# Altium project STM32F429IGT6.PrjPCB
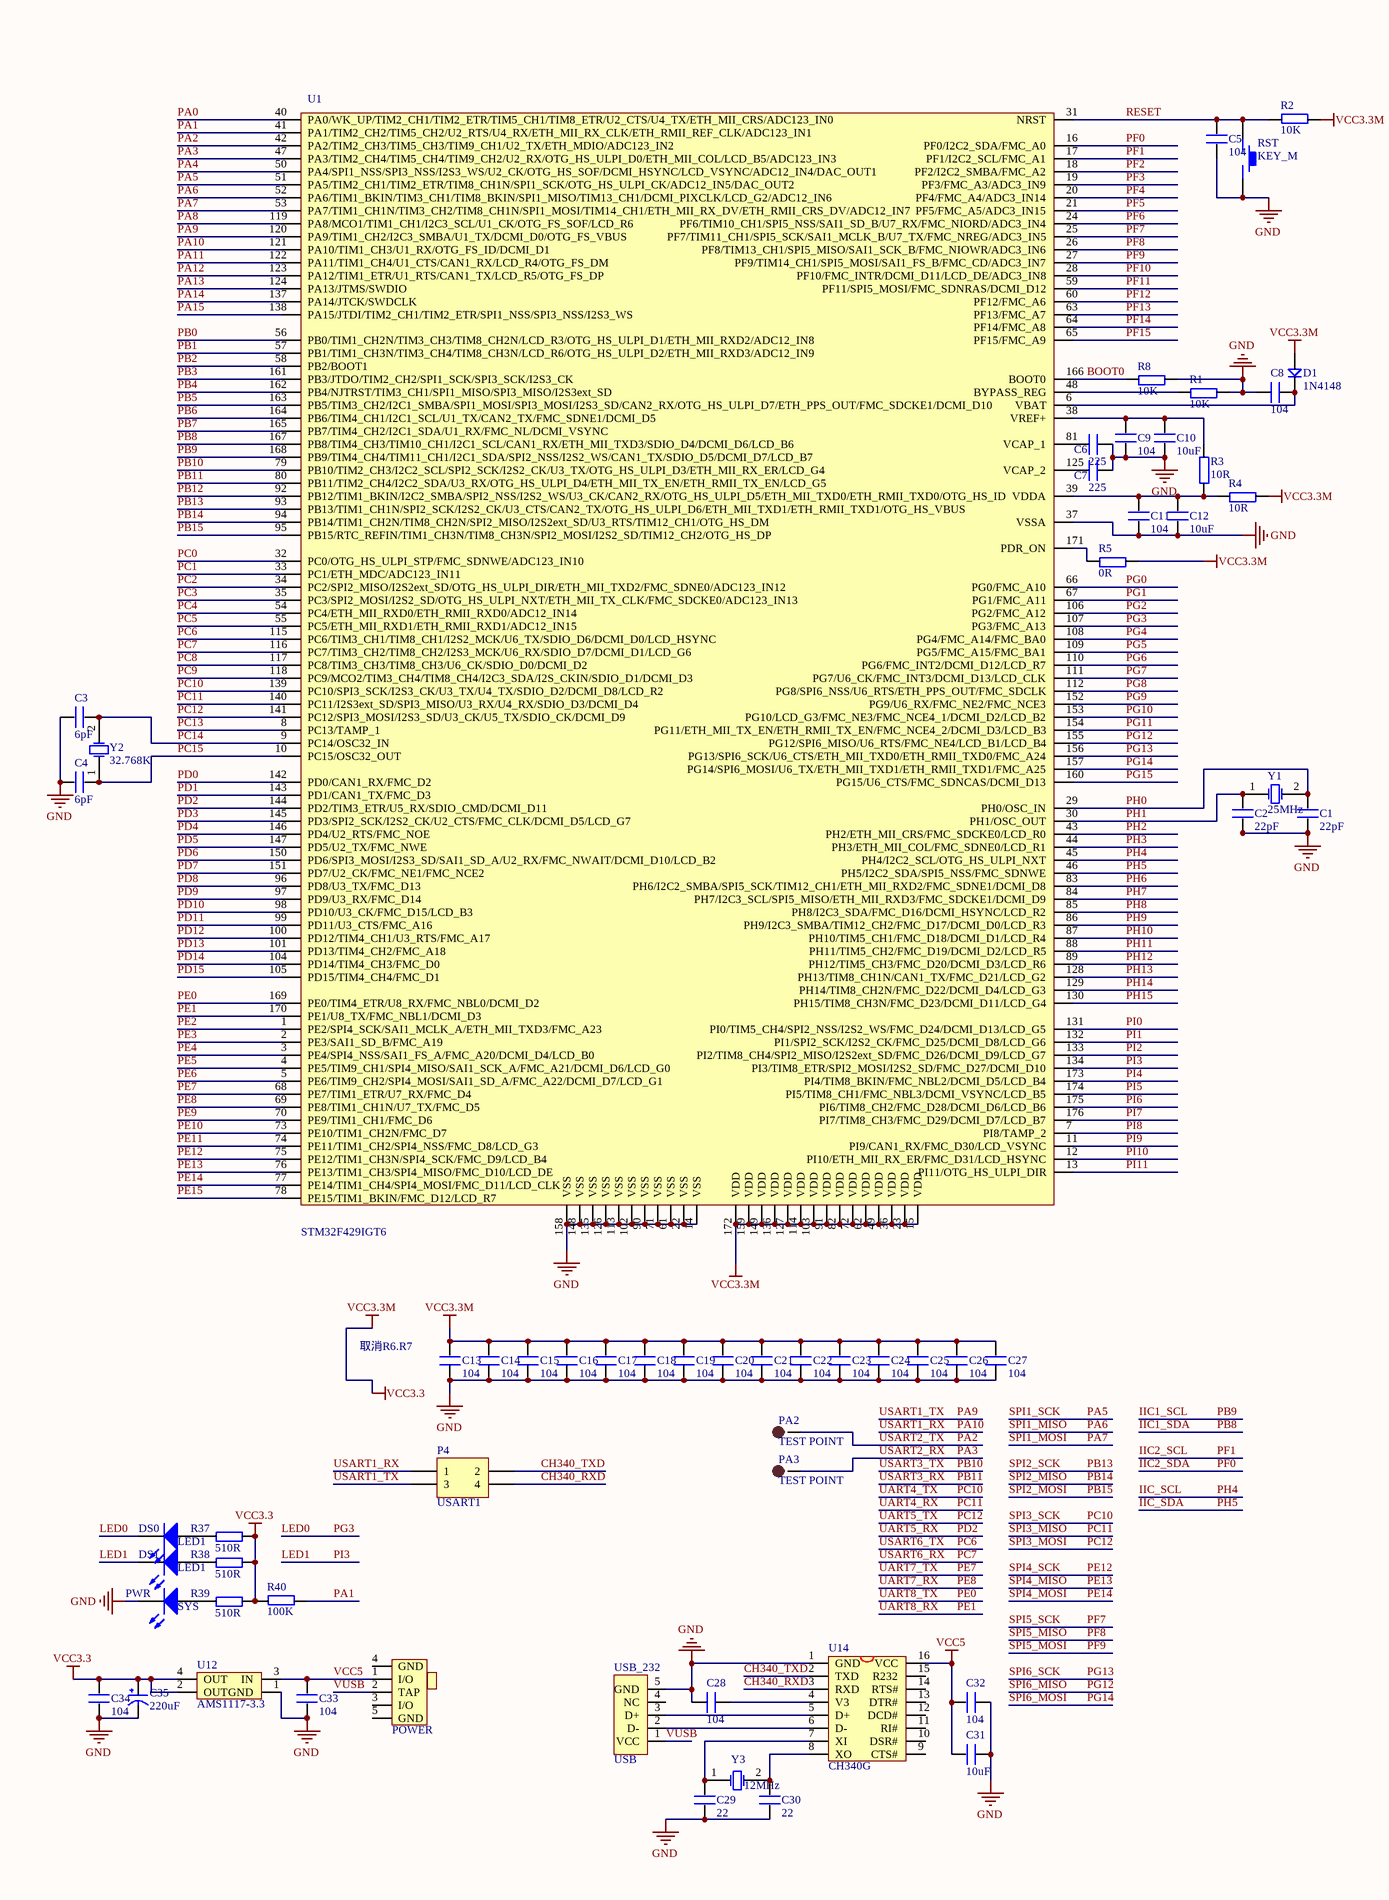
[diagram p0: STM32F429IGT6.SchDoc, left]
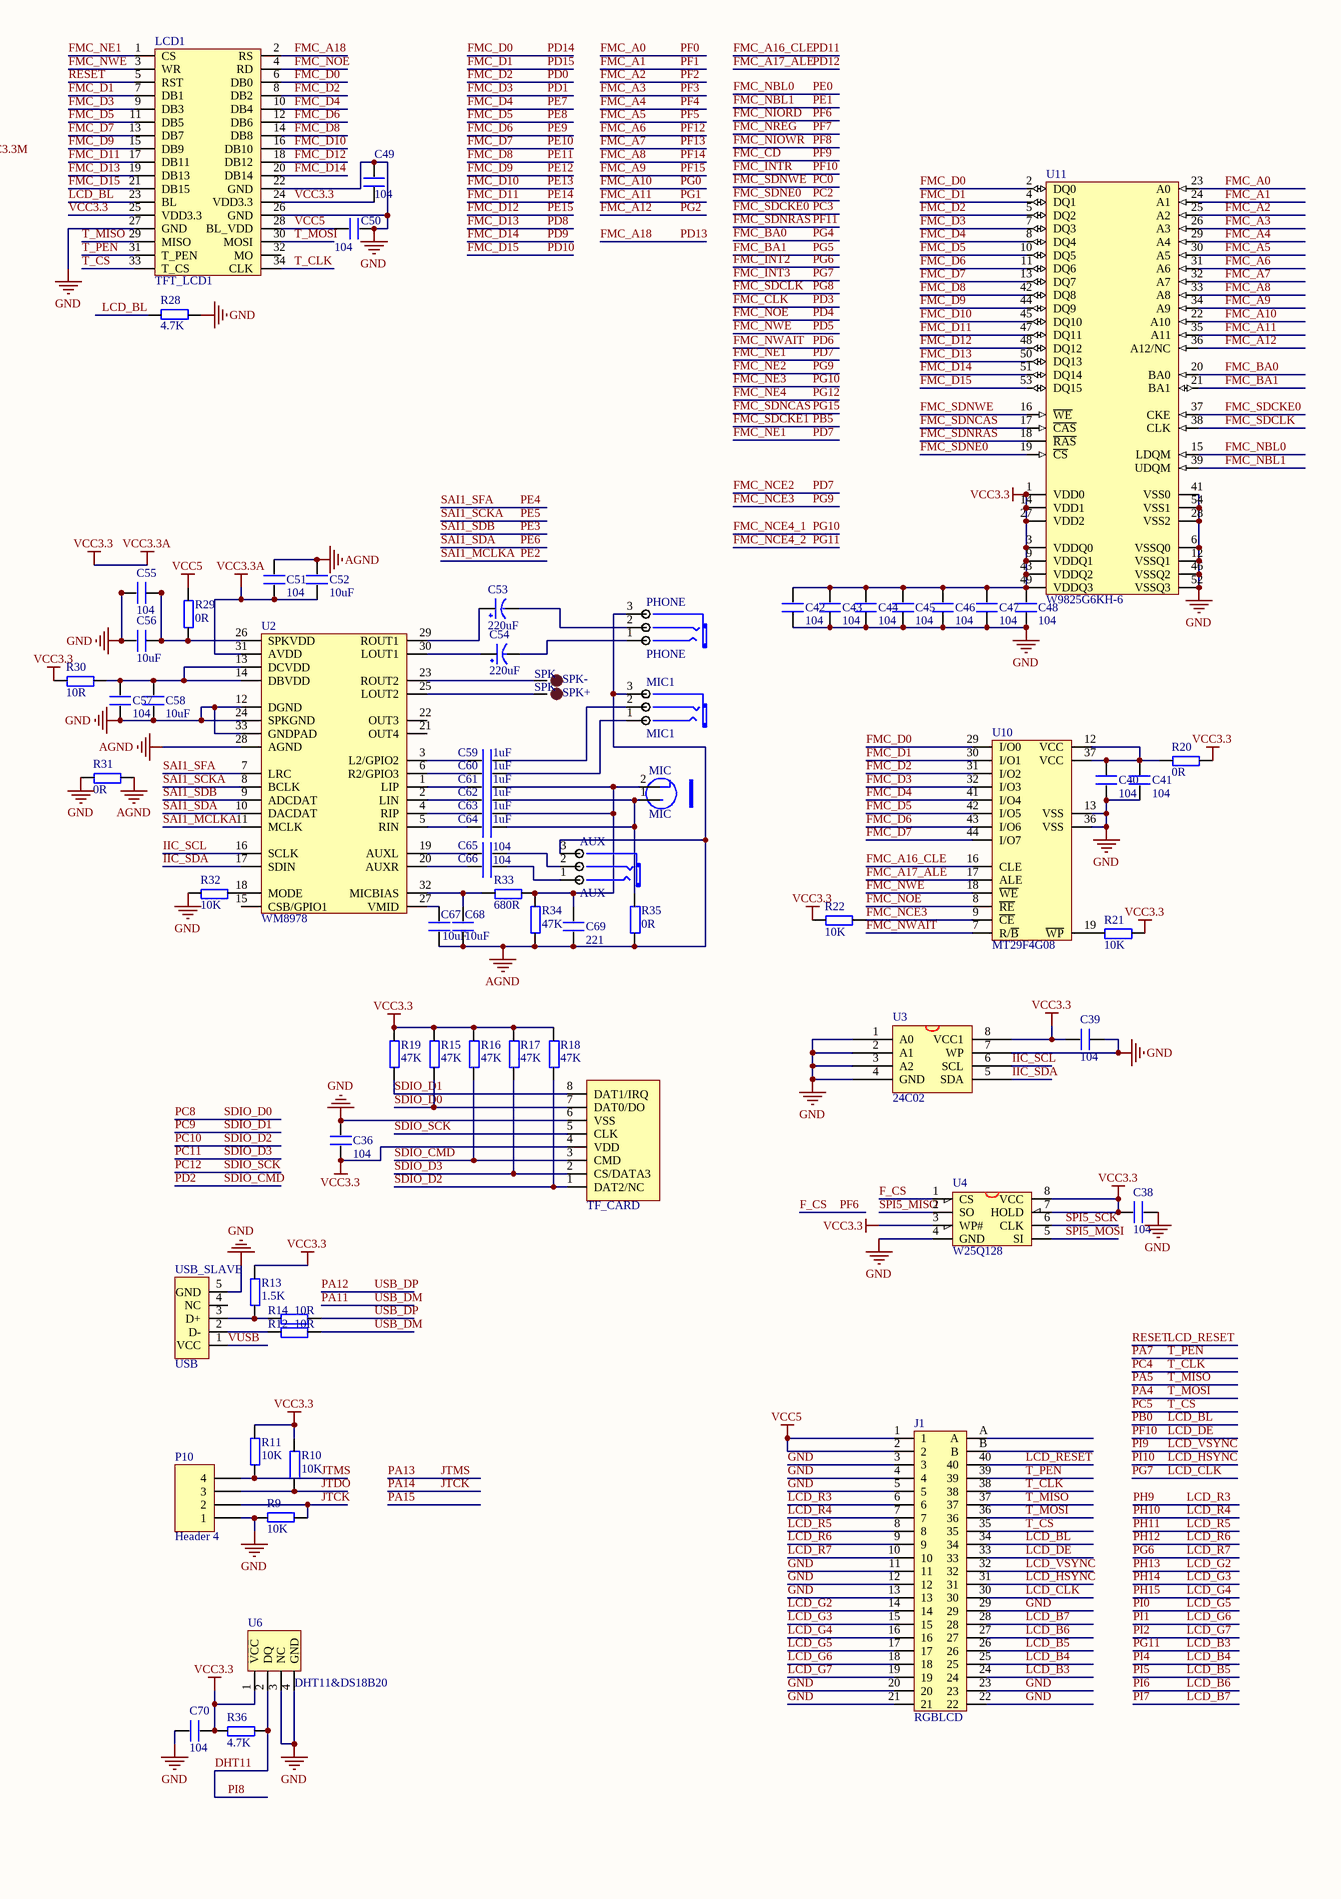
[diagram p1: STM32F429IGT6.SchDoc, right]
1 sheet, 135 parts. Net scope: global (net labels, ports and power ports of the same name join across sheets).
Board file: STM32F429IGT6.PcbDoc

## Sheet STM32F429IGT6.SchDoc
size A2

### Parts
AUX  AUX  [PHONE_ST]
C1  22pF  [C 0603_M]
C2  22pF  [C 0603_M]
C3  6pF  [C 0603_M]
C4  6pF  [C 0603_M]
C5  104  [C 0603_M]
C6  225  [C 0603_M]
C7  225  [C 0603_M]
C8  104  [C 0603_M]
C9  104  [C 0603_M]
C10  10uF  [C 0603_M]
C11  104  [C 0603_M]
C12  10uF  [C 0603_M]
C13  104  [C 0603_M]
C14  104  [C 0603_M]
C15  104  [C 0603_M]
C16  104  [C 0603_M]
C17  104  [C 0603_M]
C18  104  [C 0603_M]
C19  104  [C 0603_M]
C20  104  [C 0603_M]
C21  104  [C 0603_M]
C22  104  [C 0603_M]
C23  104  [C 0603_M]
C24  104  [C 0603_M]
C25  104  [C 0603_M]
C26  104  [C 0603_M]
C27  104  [C 0603_M]
C28  104  [C 0603_M]
C29  22  [C 0603_M]
C30  22  [C 0603_M]
C31  10uF  [C 0603_M]
C32  104  [C 0603_M]
C33  104  [C 0603_M]
C34  104  [C 0603_M]
C35  220uF  [CT 6*6 - C]
C36  104  [C 0603_M]
C38  104  [C 0603_M]
C39  104  [C 0603_M]
C40  104  [C 0603_M]
C41  104  [C 0603_M]
C42  104  [C 0603_M]
C43  104  [C 0603_M]
C44  104  [C 0603_M]
C45  104  [C 0603_M]
C46  104  [C 0603_M]
C47  104  [C 0603_M]
C48  104  [C 0603_M]
C49  104  [C 0603_M]
C50  104  [C 0603_M]
C51  104  [C 0603_M]
C52  10uF  [C 0603_M]
C53  220uF  [cc4*5.4]
C54  220uF  [cc4*5.4]
C55  104  [C 0603_M]
C56  10uF  [C 0603_M]
C57  104  [C 0603_M]
C58  10uF  [C 0603_M]
C59  1uF  [C 0603_M]
C60  1uF  [C 0603_M]
C61  1uF  [C 0603_M]
C62  1uF  [C 0603_M]
C63  1uF  [C 0603_M]
C64  1uF  [C 0603_M]
C65  104  [C 0603_M]
C66  104  [C 0603_M]
C67  10uF  [C 0603_M]
C68  10uF  [C 0603_M]
C69  221  [C 0603_M]
C70  104  [C 0603_M]
D1  1N4148  [DIODE_SOP]
DS0  LED1  [SMDLED]
DS1  LED1  [SMDLED]
J1  RGBLCD  [FPC-TOP40]
LCD1  TFT_LCD1  [DB2*17-3.5]
MIC  MIC  [MIC-6022]
MIC1  MIC1  [PHONE_ST]
P4  USART1  [HDR2.54-LI-2x2P]
P10  Header 4  [HDR2.54-LI-4P]
PA2  TEST POINT  [TP-1.5]
PA3  TEST POINT  [TP-1.5]
PHONE  PHONE  [PHONE_ST]
POWER  BUTTON_DIP3  [BTN8.8*4.6]  (value not drawn)
PWR  SYS  [SMDLED]
R1  10K  [R 0603_M]
R2  10K  [R 0603_M]
R3  10R  [R 0603_M]
R4  10R  [R 0603_M]
R5  0R  [R 0603_M]
R8  10K  [R 0603_M]
R9  10K  [R 0603_M]
R10  10K  [R 0603_M]
R11  10K  [R 0603_M]
R12  10R  [R 0603_M]
R13  1.5K  [R 0603_M]
R14  10R  [R 0603_M]
R15  47K  [R 0603_M]
R16  47K  [R 0603_M]
R17  47K  [R 0603_M]
R18  47K  [R 0603_M]
R19  47K  [R 0603_M]
R20  0R  [R 0603_M]
R21  10K  [R 0603_M]
R22  10K  [R 0603_M]
R28  4.7K  [R 0603_M]
R29  0R  [R 0603_M]
R30  10R  [R 0603_M]
R31  0R  [R 0603_M]
R32  10K  [R 0603_M]
R33  680R  [R 0603_M]
R34  47K  [R 0603_M]
R35  0R  [R 0603_M]
R36  4.7K  [R 0603_M]
R37  510R  [R 0603_M]
R38  510R  [R 0603_M]
R39  510R  [R 0603_M]
R40  100K  [R 0603_M]
RST  KEY_M  [TSW SMD-3*6*2.5]
SPK+  SPK  [TP-1.5]
SPK-  SPK  [TP-1.5]
TF_CARD  SD-MICRO-TF  [SD-MICRO-TF]  (value not drawn)
U1  STM32F429IGT6  [LQFP176]
U2  WM8978  [qfn32]
U3  24C02  [SOP8_M]
U4  W25Q128  [SOIC-8]
U6  DHT11&DS18B20  [DHT11]
U10  MT29F4G08  [TSOP48]
U11  W9825G6KH-6  [TSOP54]
U12  AMS1117-3.3  [AMS1117]
U14  CH340G  [SOP16_M]
USB_232  USB  [USB-MINI-A]
USB_SLAVE  USB  [USB-MINI-A]
Y1  25MHz  [OSC HC-49S]
Y2  32.768K  [OSC-2x6-WI-A]
Y3  12MHz  [OSC HC-49S]

### Nets
AGND: AUX.3(COM) C51.2 C52.2 C67.1 C68.1 C69.1 MIC1.3(COM) PHONE.3(COM) R31.2 R34.1 R35.1 U2.28(AGND)
GND: C1.2 C2.2 C3.1 C4.1 C5.1 C6.1 C7.1 C8.1 C9.1 C10.1 C11.1 C12.1 C13.1 C14.1 C15.1 C16.1 C17.1 C18.1 C19.1 C20.1 C21.1 C22.1 C23.1 C24.1 C25.1 C26.1 C27.1 C28.1 C29.1 C30.2 C31.2 C32.2 C33.1 C34.1 C35.2(GND) C36.2 C38.2 C39.2 C40.1 C41.1 C42.1 C43.1 C44.1 C45.1 C46.1 C47.1 C48.1 C49.2 C50.1 C55.1 C56.1 C57.1 C58.1 C70.1 J1.3 J1.4 J1.5 J1.11 J1.12 J1.13 J1.20 J1.21 J1.22 J1.23 J1.29 LCD1.22(GND) LCD1.26(GND) LCD1.27(GND) P10.1 PWR.2(K) R1.2 R8.2 R9.2 R28.1 R31.1 R32.1 RST.2 TF_CARD.6(VSS) U1.14(VSS) U1.22(VSS) U1.37(VSSA) U1.61(VSS) U1.71(VSS) U1.90(VSS) U1.102(VSS) U1.113(VSS) U1.126(VSS) U1.135(VSS) U1.148(VSS) U1.158(VSS) U2.12(DGND) U2.24(SPKGND) U2.33(GNDPAD) U3.1(A0) U3.2(A1) U3.3(A2) U3.4(GND) U3.7(WP) U4.4(GND) U6.3(NC) U6.4(GND) U10.13(VSS) U10.36(VSS) U11.6(VSSQ0) U11.12(VSSQ1) U11.28(VSS2) U11.41(VSS0) U11.46(VSSQ2) U11.52(VSSQ3) U11.54(VSS1) U12.1(GND) U14.1(GND) USB_232.5(GND) USB_SLAVE.5(GND)
VCC3.3: C13.2 C14.2 C15.2 C16.2 C17.2 C18.2 C19.2 C20.2 C21.2 C22.2 C23.2 C24.2 C25.2 C26.2 C27.2 C34.2 C35.1(VCC) C36.1 C38.1 C39.1 C42.2 C43.2 C44.2 C45.2 C46.2 C47.2 C48.2 C49.1 C51.1 C52.1 C70.2 D1.1 LCD1.24(VDD3.3) LCD1.25(VDD3.3) R2.1 R4.2 R5.2 R10.2 R11.2 R13.2 R15.2 R16.2 R17.2 R18.2 R19.2 R20.2 R21.2 R22.1 R30.1 R36.1 R37.2 R38.2 R39.2 R40.2 TF_CARD.4(VDD) U1.15(VDD) U1.23(VDD) U1.36(VDD) U1.49(VDD) U1.62(VDD) U1.72(VDD) U1.82(VDD) U1.91(VDD) U1.103(VDD) U1.114(VDD) U1.127(VDD) U1.136(VDD) U1.149(VDD) U1.159(VDD) U1.172(VDD) U2.31(AVDD) U3.8(VCC1) U4.3(WP#) U4.7(HOLD) U4.8(VCC) U6.1(VCC) U11.1(VDD0) U11.3(VDDQ0) U11.9(VDDQ1) U11.14(VDD1) U11.27(VDD2) U11.43(VDDQ2) U11.49(VDDQ3) U12.2(OUT) U12.4(OUT)  [also labelled VCC3.3A, VCC3.3M]
VCC5: C31.1 C32.1 C33.2 C50.2 J1.1 J1.2 LCD1.28(BL_VDD) POWER.1(I/O) R29.2 U12.3(IN) U14.16(VCC)
BOOT0: R8.1 U1.166(BOOT0)
CH340_RXD: P4.4 U14.3(RXD)
CH340_TXD: P4.2 U14.2(TXD)
DHT11: R36.2 U1.7(PI8/TAMP_2) U6.2(DQ)  [also labelled PI8]
F_CS: U1.24(PF6/TIM10_CH1/SPI5_NSS/SAI1_SD_B/U7_RX/FMC_NIORD/ADC3_IN4) U4.1(CS)  [also labelled FMC_NIORD, PF6]
FMC_A0: U1.16(PF0/I2C2_SDA/FMC_A0) U11.23(A0)  [also labelled IIC2_SDA, PF0]
FMC_A1: U1.17(PF1/I2C2_SCL/FMC_A1) U11.24(A1)  [also labelled IIC2_SCL, PF1]
FMC_A2: U1.18(PF2/I2C2_SMBA/FMC_A2) U11.25(A2)  [also labelled PF2]
FMC_A3: U1.19(PF3/FMC_A3/ADC3_IN9) U11.26(A3)  [also labelled PF3]
FMC_A4: U1.20(PF4/FMC_A4/ADC3_IN14) U11.29(A4)  [also labelled PF4]
FMC_A5: U1.21(PF5/FMC_A5/ADC3_IN15) U11.30(A5)  [also labelled PF5]
FMC_A6: U1.60(PF12/FMC_A6) U11.31(A6)  [also labelled PF12]
FMC_A7: U1.63(PF13/FMC_A7) U11.32(A7)  [also labelled PF13]
FMC_A8: U1.64(PF14/FMC_A8) U11.33(A8)  [also labelled PF14]
FMC_A9: U1.65(PF15/FMC_A9) U11.34(A9)  [also labelled PF15]
FMC_A10: U1.66(PG0/FMC_A10) U11.22(A10)  [also labelled PG0]
FMC_A11: U1.67(PG1/FMC_A11) U11.35(A11)  [also labelled PG1]
FMC_A12: U1.106(PG2/FMC_A12) U11.36(A12/NC)  [also labelled PG2]
FMC_A16_CLE: U1.99(PD11/U3_CTS/FMC_A16) U10.16(CLE)  [also labelled PD11]
FMC_A17_ALE: U1.100(PD12/TIM4_CH1/U3_RTS/FMC_A17) U10.17(ALE)  [also labelled PD12]
FMC_A18: LCD1.2(RS) U1.101(PD13/TIM4_CH2/FMC_A18)  [also labelled PD13]
FMC_BA0: U1.108(PG4/FMC_A14/FMC_BA0) U11.20(BA0)  [also labelled PG4]
FMC_BA1: U1.109(PG5/FMC_A15/FMC_BA1) U11.21(BA1)  [also labelled PG5]
FMC_CD: U1.27(PF9/TIM14_CH1/SPI5_MOSI/SAI1_FS_B/FMC_CD/ADC3_IN7) U4.5(SI)  [also labelled PF9, SPI5_MOSI]
FMC_CLK: U1.145(PD3/SPI2_SCK/I2S2_CK/U2_CTS/FMC_CLK/DCMI_D5/LCD_G7)  [also labelled PD3]
FMC_D0: LCD1.6(DB0) U1.104(PD14/TIM4_CH3/FMC_D0) U10.29(I/O0) U11.2(DQ0)  [also labelled PD14]
FMC_D1: LCD1.7(DB1) U1.105(PD15/TIM4_CH4/FMC_D1) U10.30(I/O1) U11.4(DQ1)  [also labelled PD15]
FMC_D2: LCD1.8(DB2) U1.142(PD0/CAN1_RX/FMC_D2) U10.31(I/O2) U11.5(DQ2)  [also labelled PD0]
FMC_D3: LCD1.9(DB3) U1.143(PD1/CAN1_TX/FMC_D3) U10.32(I/O3) U11.7(DQ3)  [also labelled PD1]
FMC_D4: LCD1.10(DB4) U1.68(PE7/TIM1_ETR/U7_RX/FMC_D4) U10.41(I/O4) U11.8(DQ4)  [also labelled PE7, UART7_TX]
FMC_D5: LCD1.11(DB5) U1.69(PE8/TIM1_CH1N/U7_TX/FMC_D5) U10.42(I/O5) U11.10(DQ5)  [also labelled PE8, UART7_RX]
FMC_D6: LCD1.12(DB6) U1.70(PE9/TIM1_CH1/FMC_D6) U10.43(I/O6) U11.11(DQ6)  [also labelled PE9]
FMC_D7: LCD1.13(DB7) U1.73(PE10/TIM1_CH2N/FMC_D7) U10.44(I/O7) U11.13(DQ7)  [also labelled PE10]
FMC_D8: LCD1.14(DB8) U1.74(PE11/TIM1_CH2/SPI4_NSS/FMC_D8/LCD_G3) U11.42(DQ8)  [also labelled PE11]
FMC_D9: LCD1.15(DB9) U1.75(PE12/TIM1_CH3N/SPI4_SCK/FMC_D9/LCD_B4) U11.44(DQ9)  [also labelled PE12, SPI4_SCK]
FMC_D10: LCD1.16(DB10) U1.76(PE13/TIM1_CH3/SPI4_MISO/FMC_D10/LCD_DE) U11.45(DQ10)  [also labelled PE13, SPI4_MISO]
FMC_D11: LCD1.17(DB11) U1.77(PE14/TIM1_CH4/SPI4_MOSI/FMC_D11/LCD_CLK) U11.47(DQ11)  [also labelled PE14, SPI4_MOSI]
FMC_D12: LCD1.18(DB12) U1.78(PE15/TIM1_BKIN/FMC_D12/LCD_R7) U11.48(DQ12)  [also labelled PE15]
FMC_D13: LCD1.19(DB13) U1.96(PD8/U3_TX/FMC_D13) U11.50(DQ13)  [also labelled PD8]
FMC_D14: LCD1.20(DB14) U1.97(PD9/U3_RX/FMC_D14) U11.51(DQ14)  [also labelled PD9]
FMC_D15: LCD1.21(DB15) U1.98(PD10/U3_CK/FMC_D15/LCD_B3) U11.53(DQ15)  [also labelled PD10]
FMC_INT2: J1.10 U1.110(PG6/FMC_INT2/DCMI_D12/LCD_R7)  [also labelled LCD_R7, PG6]
FMC_INT3: J1.30 U1.111(PG7/U6_CK/FMC_INT3/DCMI_D13/LCD_CLK)  [also labelled LCD_CLK, PG7]
FMC_INTR: J1.33 U1.28(PF10/FMC_INTR/DCMI_D11/LCD_DE/ADC3_IN8)  [also labelled LCD_DE, PF10]
FMC_NBL0: U1.169(PE0/TIM4_ETR/U8_RX/FMC_NBL0/DCMI_D2) U11.15(LDQM)  [also labelled PE0, UART8_TX]
FMC_NBL1: U1.170(PE1/U8_TX/FMC_NBL1/DCMI_D3) U11.39(UDQM)  [also labelled PE1, UART8_RX]
FMC_NCE2: LCD1.1(CS) U1.151(PD7/U2_CK/FMC_NE1/FMC_NCE2)  [also labelled FMC_NE1, PD7]
FMC_NCE3: R22.2 U1.152(PG9/U6_RX/FMC_NE2/FMC_NCE3) U10.9(~{CE})  [also labelled FMC_NE2, PG9]
FMC_NCE4_1: U1.153(PG10/LCD_G3/FMC_NE3/FMC_NCE4_1/DCMI_D2/LCD_B2)  [also labelled FMC_NE3, PG10]
FMC_NCE4_2: J1.24 U1.154(PG11/ETH_MII_TX_EN/ETH_RMII_TX_EN/FMC_NCE4_2/DCMI_D3/LCD_B3)  [also labelled LCD_B3, PG11]
FMC_NE4: U1.155(PG12/SPI6_MISO/U6_RTS/FMC_NE4/LCD_B1/LCD_B4)  [also labelled PG12, SPI6_MISO]
FMC_NIOWR: U1.26(PF8/TIM13_CH1/SPI5_MISO/SAI1_SCK_B/FMC_NIOWR/ADC3_IN6) U4.2(SO)  [also labelled PF8, SPI5_MISO]
FMC_NOE: LCD1.4(RD) U1.146(PD4/U2_RTS/FMC_NOE) U10.8(~{RE})  [also labelled PD4]
FMC_NREG: U1.25(PF7/TIM11_CH1/SPI5_SCK/SAI1_MCLK_B/U7_TX/FMC_NREG/ADC3_IN5) U4.6(CLK)  [also labelled PF7, SPI5_SCK]
FMC_NWAIT: U1.150(PD6/SPI3_MOSI/I2S3_SD/SAI1_SD_A/U2_RX/FMC_NWAIT/DCMI_D10/LCD_B2) U10.7(R/~{B})  [also labelled PD6]
FMC_NWE: LCD1.3(WR) U1.147(PD5/U2_TX/FMC_NWE) U10.18(~{WE})  [also labelled PD5]
FMC_SDCKE0: U1.35(PC3/SPI2_MOSI/I2S2_SD/OTG_HS_ULPI_NXT/ETH_MII_TX_CLK/FMC_SDCKE0/ADC123_IN13) U11.37(CKE)  [also labelled PC3]
FMC_SDCKE1: U1.163(PB5/TIM3_CH2/I2C1_SMBA/SPI1_MOSI/SPI3_MOSI/I2S3_SD/CAN2_RX/OTG_HS_ULPI_D7/ETH_PPS_OUT/FMC_SDCKE1/DCMI_D10)  [also labelled PB5]
FMC_SDCLK: U1.112(PG8/SPI6_NSS/U6_RTS/ETH_PPS_OUT/FMC_SDCLK) U11.38(CLK)  [also labelled PG8]
FMC_SDNCAS: U1.160(PG15/U6_CTS/FMC_SDNCAS/DCMI_D13) U11.17(~{CAS})  [also labelled PG15]
FMC_SDNE0: U1.34(PC2/SPI2_MISO/I2S2ext_SD/OTG_HS_ULPI_DIR/ETH_MII_TXD2/FMC_SDNE0/ADC123_IN12) U11.19(~{CS})  [also labelled PC2]
FMC_SDNRAS: U1.59(PF11/SPI5_MOSI/FMC_SDNRAS/DCMI_D12) U11.18(~{RAS})  [also labelled PF11]
FMC_SDNWE: U1.32(PC0/OTG_HS_ULPI_STP/FMC_SDNWE/ADC123_IN10) U11.16(~{WE})  [also labelled PC0]
IIC1_SCL: U1.168(PB9/TIM4_CH4/TIM11_CH1/I2C1_SDA/SPI2_NSS/I2S2_WS/CAN1_TX/SDIO_D5/DCMI_D7/LCD_B7)  [also labelled PB9]
IIC1_SDA: U1.167(PB8/TIM4_CH3/TIM10_CH1/I2C1_SCL/CAN1_RX/ETH_MII_TXD3/SDIO_D4/DCMI_D6/LCD_B6)  [also labelled PB8]
IIC_SCL: U1.45(PH4/I2C2_SCL/OTG_HS_ULPI_NXT) U2.16(SCLK) U3.6(SCL)  [also labelled PH4]
IIC_SDA: U1.46(PH5/I2C2_SDA/SPI5_NSS/FMC_SDNWE) U2.17(SDIN) U3.5(SDA)  [also labelled PH5]
JTCK: P10.2 R9.1 U1.137(PA14/JTCK/SWDCLK)  [also labelled PA14]
JTDO: P10.3 R10.1
JTMS: P10.4 R11.1 U1.124(PA13/JTMS/SWDIO)  [also labelled PA13]
LCD_B4: J1.25 U1.173(PI4/TIM8_BKIN/FMC_NBL2/DCMI_D5/LCD_B4)  [also labelled PI4]
LCD_B5: J1.26 U1.174(PI5/TIM8_CH1/FMC_NBL3/DCMI_VSYNC/LCD_B5)  [also labelled PI5]
LCD_B6: J1.27 U1.175(PI6/TIM8_CH2/FMC_D28/DCMI_D6/LCD_B6)  [also labelled PI6]
LCD_B7: J1.28 U1.176(PI7/TIM8_CH3/FMC_D29/DCMI_D7/LCD_B7)  [also labelled PI7]
LCD_BL: J1.34 LCD1.23(BL) R28.2 U1.56(PB0/TIM1_CH2N/TIM3_CH3/TIM8_CH2N/LCD_R3/OTG_HS_ULPI_D1/ETH_MII_RXD2/ADC12_IN8)  [also labelled PB0]
LCD_G2: J1.14 U1.128(PH13/TIM8_CH1N/CAN1_TX/FMC_D21/LCD_G2)  [also labelled PH13]
LCD_G3: J1.15 U1.129(PH14/TIM8_CH2N/FMC_D22/DCMI_D4/LCD_G3)  [also labelled PH14]
LCD_G4: J1.16 U1.130(PH15/TIM8_CH3N/FMC_D23/DCMI_D11/LCD_G4)  [also labelled PH15]
LCD_G5: J1.17 U1.131(PI0/TIM5_CH4/SPI2_NSS/I2S2_WS/FMC_D24/DCMI_D13/LCD_G5)  [also labelled PI0]
LCD_G6: J1.18 U1.132(PI1/SPI2_SCK/I2S2_CK/FMC_D25/DCMI_D8/LCD_G6)  [also labelled PI1]
LCD_G7: J1.19 U1.133(PI2/TIM8_CH4/SPI2_MISO/I2S2ext_SD/FMC_D26/DCMI_D9/LCD_G7)  [also labelled PI2]
LCD_HSYNC: J1.31 U1.12(PI10/ETH_MII_RX_ER/FMC_D31/LCD_HSYNC)  [also labelled PI10]
LCD_R3: J1.6 U1.86(PH9/I2C3_SMBA/TIM12_CH2/FMC_D17/DCMI_D0/LCD_R3)  [also labelled PH9]
LCD_R4: J1.7 U1.87(PH10/TIM5_CH1/FMC_D18/DCMI_D1/LCD_R4)  [also labelled PH10]
LCD_R5: J1.8 U1.88(PH11/TIM5_CH2/FMC_D19/DCMI_D2/LCD_R5)  [also labelled PH11]
LCD_R6: J1.9 U1.89(PH12/TIM5_CH3/FMC_D20/DCMI_D3/LCD_R6)  [also labelled PH12]
LCD_RESET: C5.2 J1.40 LCD1.5(RST) R2.2 RST.1 U1.31(NRST)  [also labelled RESET]
LCD_VSYNC: J1.32 U1.11(PI9/CAN1_RX/FMC_D30/LCD_VSYNC)  [also labelled PI9]
LED0: DS0.2(K) U1.107(PG3/FMC_A13)  [also labelled PG3]
LED1: DS1.2(K) U1.134(PI3/TIM8_ETR/SPI2_MOSI/I2S2_SD/FMC_D27/DCMI_D10)  [also labelled PI3]
PA0: U1.40(PA0/WK_UP/TIM2_CH1/TIM2_ETR/TIM5_CH1/TIM8_ETR/U2_CTS/U4_TX/ETH_MII_CRS/ADC123_IN0)
PA1: R40.1 U1.41(PA1/TIM2_CH2/TIM5_CH2/U2_RTS/U4_RX/ETH_MII_RX_CLK/ETH_RMII_REF_CLK/ADC123_IN1)
PA2: PA2.1 U1.42(PA2/TIM2_CH3/TIM5_CH3/TIM9_CH1/U2_TX/ETH_MDIO/ADC123_IN2)  [also labelled USART2_TX]
PA3: PA3.1 U1.47(PA3/TIM2_CH4/TIM5_CH4/TIM9_CH2/U2_RX/OTG_HS_ULPI_D0/ETH_MII_COL/LCD_B5/ADC123_IN3)  [also labelled USART2_RX]
PA4: J1.36 LCD1.30(MOSI) U1.50(PA4/SPI1_NSS/SPI3_NSS/I2S3_WS/U2_CK/OTG_HS_SOF/DCMI_HSYNC/LCD_VSYNC/ADC12_IN4/DAC_OUT1)  [also labelled T_MOSI]
PA5: J1.37 LCD1.29(MISO) U1.51(PA5/TIM2_CH1/TIM2_ETR/TIM8_CH1N/SPI1_SCK/OTG_HS_ULPI_CK/ADC12_IN5/DAC_OUT2)  [also labelled SPI1_SCK, T_MISO]
PA6: U1.52(PA6/TIM1_BKIN/TIM3_CH1/TIM8_BKIN/SPI1_MISO/TIM13_CH1/DCMI_PIXCLK/LCD_G2/ADC12_IN6)  [also labelled SPI1_MISO]
PA7: J1.39 LCD1.31(T_PEN) U1.53(PA7/TIM1_CH1N/TIM3_CH2/TIM8_CH1N/SPI1_MOSI/TIM14_CH1/ETH_MII_RX_DV/ETH_RMII_CRS_DV/ADC12_IN7)  [also labelled SPI1_MOSI, T_PEN]
PA8: U1.119(PA8/MCO1/TIM1_CH1/I2C3_SCL/U1_CK/OTG_FS_SOF/LCD_R6)
PA9: P4.3 U1.120(PA9/TIM1_CH2/I2C3_SMBA/U1_TX/DCMI_D0/OTG_FS_VBUS)  [also labelled USART1_TX]
PA10: P4.1 U1.121(PA10/TIM1_CH3/U1_RX/OTG_FS_ID/DCMI_D1)  [also labelled USART1_RX]
PA11: R12.2 U1.122(PA11/TIM1_CH4/U1_CTS/CAN1_RX/LCD_R4/OTG_FS_DM)  [also labelled USB_DM]
PA12: R14.2 U1.123(PA12/TIM1_ETR/U1_RTS/CAN1_TX/LCD_R5/OTG_FS_DP)  [also labelled USB_DP]
PA15: U1.138(PA15/JTDI/TIM2_CH1/TIM2_ETR/SPI1_NSS/SPI3_NSS/I2S3_WS)
PB1: U1.57(PB1/TIM1_CH3N/TIM3_CH4/TIM8_CH3N/LCD_R6/OTG_HS_ULPI_D2/ETH_MII_RXD3/ADC12_IN9)
PB2: U1.58(PB2/BOOT1)
PB3: U1.161(PB3/JTDO/TIM2_CH2/SPI1_SCK/SPI3_SCK/I2S3_CK)
PB4: U1.162(PB4/NJTRST/TIM3_CH1/SPI1_MISO/SPI3_MISO/I2S3ext_SD)
PB6: U1.164(PB6/TIM4_CH1/I2C1_SCL/U1_TX/CAN2_TX/FMC_SDNE1/DCMI_D5)
PB7: U1.165(PB7/TIM4_CH2/I2C1_SDA/U1_RX/FMC_NL/DCMI_VSYNC)
PB10: U1.79(PB10/TIM2_CH3/I2C2_SCL/SPI2_SCK/I2S2_CK/U3_TX/OTG_HS_ULPI_D3/ETH_MII_RX_ER/LCD_G4)  [also labelled USART3_TX]
PB11: U1.80(PB11/TIM2_CH4/I2C2_SDA/U3_RX/OTG_HS_ULPI_D4/ETH_MII_TX_EN/ETH_RMII_TX_EN/LCD_G5)  [also labelled USART3_RX]
PB12: U1.92(PB12/TIM1_BKIN/I2C2_SMBA/SPI2_NSS/I2S2_WS/U3_CK/CAN2_RX/OTG_HS_ULPI_D5/ETH_MII_TXD0/ETH_RMII_TXD0/OTG_HS_ID)
PB13: U1.93(PB13/TIM1_CH1N/SPI2_SCK/I2S2_CK/U3_CTS/CAN2_TX/OTG_HS_ULPI_D6/ETH_MII_TXD1/ETH_RMII_TXD1/OTG_HS_VBUS)  [also labelled SPI2_SCK]
PB14: U1.94(PB14/TIM1_CH2N/TIM8_CH2N/SPI2_MISO/I2S2ext_SD/U3_RTS/TIM12_CH1/OTG_HS_DM)  [also labelled SPI2_MISO]
PB15: U1.95(PB15/RTC_REFIN/TIM1_CH3N/TIM8_CH3N/SPI2_MOSI/I2S2_SD/TIM12_CH2/OTG_HS_DP)  [also labelled SPI2_MOSI]
PC1: U1.33(PC1/ETH_MDC/ADC123_IN11)
PC4: J1.38 LCD1.34(CLK) U1.54(PC4/ETH_MII_RXD0/ETH_RMII_RXD0/ADC12_IN14)  [also labelled T_CLK]
PC5: J1.35 LCD1.33(T_CS) U1.55(PC5/ETH_MII_RXD1/ETH_RMII_RXD1/ADC12_IN15)  [also labelled T_CS]
PC6: U1.115(PC6/TIM3_CH1/TIM8_CH1/I2S2_MCK/U6_TX/SDIO_D6/DCMI_D0/LCD_HSYNC)  [also labelled USART6_TX]
PC7: U1.116(PC7/TIM3_CH2/TIM8_CH2/I2S3_MCK/U6_RX/SDIO_D7/DCMI_D1/LCD_G6)  [also labelled USART6_RX]
PC8: R15.1 TF_CARD.7(DAT0/DO) U1.117(PC8/TIM3_CH3/TIM8_CH3/U6_CK/SDIO_D0/DCMI_D2)  [also labelled SDIO_D0]
PC9: R19.1 TF_CARD.8(DAT1/IRQ) U1.118(PC9/MCO2/TIM3_CH4/TIM8_CH4/I2C3_SDA/I2S_CKIN/SDIO_D1/DCMI_D3)  [also labelled SDIO_D1]
PC10: R18.1 TF_CARD.1(DAT2/NC) U1.139(PC10/SPI3_SCK/I2S3_CK/U3_TX/U4_TX/SDIO_D2/DCMI_D8/LCD_R2)  [also labelled SDIO_D2, SPI3_SCK, UART4_TX]
PC11: R17.1 TF_CARD.2(CS/DATA3) U1.140(PC11/I2S3ext_SD/SPI3_MISO/U3_RX/U4_RX/SDIO_D3/DCMI_D4)  [also labelled SDIO_D3, SPI3_MISO, UART4_RX]
PC12: TF_CARD.5(CLK) U1.141(PC12/SPI3_MOSI/I2S3_SD/U3_CK/U5_TX/SDIO_CK/DCMI_D9)  [also labelled SDIO_SCK, SPI3_MOSI, UART5_TX]
PC13: U1.8(PC13/TAMP_1)
PC14: C3.2 U1.9(PC14/OSC32_IN) Y2.2(OSC2)
PC15: C4.2 U1.10(PC15/OSC32_OUT) Y2.1(OSC1)
PD2: R16.1 TF_CARD.3(CMD) U1.144(PD2/TIM3_ETR/U5_RX/SDIO_CMD/DCMI_D11)  [also labelled SDIO_CMD, UART5_RX]
PE2: U1.1(PE2/SPI4_SCK/SAI1_MCLK_A/ETH_MII_TXD3/FMC_A23) U2.11(MCLK)  [also labelled SAI1_MCLKA]
PE3: U1.2(PE3/SAI1_SD_B/FMC_A19) U2.9(ADCDAT)  [also labelled SAI1_SDB]
PE4: U1.3(PE4/SPI4_NSS/SAI1_FS_A/FMC_A20/DCMI_D4/LCD_B0) U2.7(LRC)  [also labelled SAI1_SFA]
PE5: U1.4(PE5/TIM9_CH1/SPI4_MISO/SAI1_SCK_A/FMC_A21/DCMI_D6/LCD_G0) U2.8(BCLK)  [also labelled SAI1_SCKA]
PE6: U1.5(PE6/TIM9_CH2/SPI4_MOSI/SAI1_SD_A/FMC_A22/DCMI_D7/LCD_G1) U2.10(DACDAT)  [also labelled SAI1_SDA]
PG13: U1.156(PG13/SPI6_SCK/U6_CTS/ETH_MII_TXD0/ETH_RMII_TXD0/FMC_A24)  [also labelled SPI6_SCK]
PG14: U1.157(PG14/SPI6_MOSI/U6_TX/ETH_MII_TXD1/ETH_RMII_TXD1/FMC_A25)  [also labelled SPI6_MOSI]
PH0: C1.1 U1.29(PH0/OSC_IN) Y1.2(OSC2)
PH1: C2.1 U1.30(PH1/OSC_OUT) Y1.1(OSC1)
PH2: U1.43(PH2/ETH_MII_CRS/FMC_SDCKE0/LCD_R0)
PH3: U1.44(PH3/ETH_MII_COL/FMC_SDNE0/LCD_R1)
PH6: U1.83(PH6/I2C2_SMBA/SPI5_SCK/TIM12_CH1/ETH_MII_RXD2/FMC_SDNE1/DCMI_D8)
PH7: U1.84(PH7/I2C3_SCL/SPI5_MISO/ETH_MII_RXD3/FMC_SDCKE1/DCMI_D9)
PH8: U1.85(PH8/I2C3_SDA/FMC_D16/DCMI_HSYNC/LCD_R2)
PI11: U1.13(PI11/OTG_HS_ULPI_DIR)
VUSB: POWER.2(TAP) USB_232.1(VCC) USB_SLAVE.1(VCC)
NetAUX_1: AUX.1(CHL) C66.2
NetAUX_2: AUX.2(CHR) C65.2
NetC6_2: C6.2 U1.81(VCAP_1)
NetC7_2: C7.2 U1.125(VCAP_2)
NetC8_2: C8.2 D1.2 U1.6(VBAT)
NetC9_2: C9.2 C10.2 R3.2 U1.38(VREF+)
NetC11_2: C11.2 C12.2 R3.1 R4.1 U1.39(VDDA)
NetC28_2: C28.2 U14.4(V3)
NetC29_2: C29.2 U14.7(XI) Y3.1(OSC1)
NetC30_1: C30.1 U14.8(XO) Y3.2(OSC2)
NetC40_2: C40.2 C41.2 R20.1 U10.12(VCC) U10.37(VCC)
NetC53_1: C53.1(VCC) U2.29(ROUT1)
NetC53_2: C53.2(GND) PHONE.2(CHR)
NetC54_1: C54.1(VCC) U2.30(LOUT1)
NetC54_2: C54.2(GND) PHONE.1(CHL)
NetC55_2: C55.2 C56.2 R29.1 U2.26(SPKVDD)
NetC57_2: C57.2 C58.2 R30.2 U2.13(DCVDD) U2.14(DBVDD)
NetC59_1: C59.1 U2.3(L2/GPIO2)
NetC59_2: C59.2 MIC1.2(CHR)
NetC60_1: C60.1 U2.6(R2/GPIO3)
NetC60_2: C60.2 MIC1.1(CHL)
NetC61_1: C61.1 U2.1(LIP)
NetC61_2: C61.2 C63.2 C69.2 MIC.2(GND) R33.2 R34.2
NetC62_1: C62.1 U2.2(LIN)
NetC62_2: C62.2 C64.2 MIC.1(VCC) R35.2
NetC63_1: C63.1 U2.4(RIP)
NetC64_1: C64.1 U2.5(RIN)
NetC65_1: C65.1 U2.19(AUXL)
NetC66_1: C66.1 U2.20(AUXR)
NetC67_2: C67.2 U2.27(VMID)
NetC68_2: C68.2 R33.1 U2.32(MICBIAS)
NetDS0_1: DS0.1(A) R37.1
NetDS1_1: DS1.1(A) R38.1
NetPWR_1: PWR.1(A) R39.1
NetR1_1: R1.1 U1.48(BYPASS_REG)
NetR5_1: R5.1 U1.171(PDR_ON)
NetR12_1: R12.1 USB_SLAVE.2(D-)
NetR13_1: R13.1 R14.1 USB_SLAVE.3(D+)
NetR21_1: R21.1 U10.19(~{WP})
NetR32_2: R32.2 U2.18(MODE)
NetSPK+_1: SPK+.1 U2.25(LOUT2)
NetSPK-_1: SPK-.1 U2.23(ROUT2)
NetU14_5: U14.5(D+) USB_232.3(D+)
NetU14_6: U14.6(D-) USB_232.2(D-)

Not connected (* = marked no-connect by the designer): J1 A B; LCD1 32(MO); POWER 3(I/O) 4(GND) 5(GND); U2 15(CSB/GPIO1) 21(OUT4) 22(OUT3); U14 9(CTS#) 10(DSR#) 11(RI#) 12(DCD#) 13(DTR#) 14(RTS#) 15(R232); USB_232 4(NC); USB_SLAVE 4(NC)

### Notes on the sheet
- (near C13) 取消R6.R7

### Library data of the parts
AUX MIC1 PHONE = PHONE_M
C1-C34 C36 C38-C52 C55-C70 = C
C35 C53 C54 = CAP
D1 = D
DS0 DS1 PWR = LED2: Typical RED, GREEN, YELLOW, AMBER GaAs LED; Published: 8-Jun-2000; LatestRevisionDate: 17-Jul-2002; LatestRevisionNote: Re-released for DXP Platform.; PackageDocument: Feb-2002; PackageReference: 3.2X1.6X1.1; Publisher: Altium Limited
J1 = FPC-40: FPC-40P-0.5mm
LCD1 = TFT_LCD2
P4 = Header 2X2: Header, 2-Pin, Dual row; LatestRevisionDate: 17-Jul-2002; LatestRevisionNote: Re-released for DXP Platform.; Publisher: Altium Limited
P10 = Header 4: Header, 4-Pin; LatestRevisionDate: 17-Jul-2002; LatestRevisionNote: Re-released for DXP Platform.; Publisher: Altium Limited
PA2 PA3 SPK+ SPK- = TEST-POINT: 测试点
POWER = BUTTON_DIP3: 拨动开关SS-12F44
R1-R5 R8-R22 R28-R40 = R
TF_CARD = SD-MICRO-TF: SD,MICRO,TF
U2 = WM8978: 24bit ADC&DAC
U3 = 24C256
U4 = W25X16: W25X16;SST25VF016;MX25L1605
U6 = DHT11: 数字温湿度传感器
U10 = K9F2G08U0C: 256MB NAND FLASH
U11 = IS42S16160B: 32MB SDRAM
U12 = AMS1117
U14 = CH340G: USB2UART
USB_232 USB_SLAVE = USB5
Y1-Y3 = XTAL: Crystal Oscillator; Published: 8-Jun-2000; LatestRevisionDate: 17-Jul-2002; LatestRevisionNote: Re-released for DXP Platform.; Publisher: Altium Limited